# Altium schematic sheet Channel_w_Stim.SchDoc
size A3
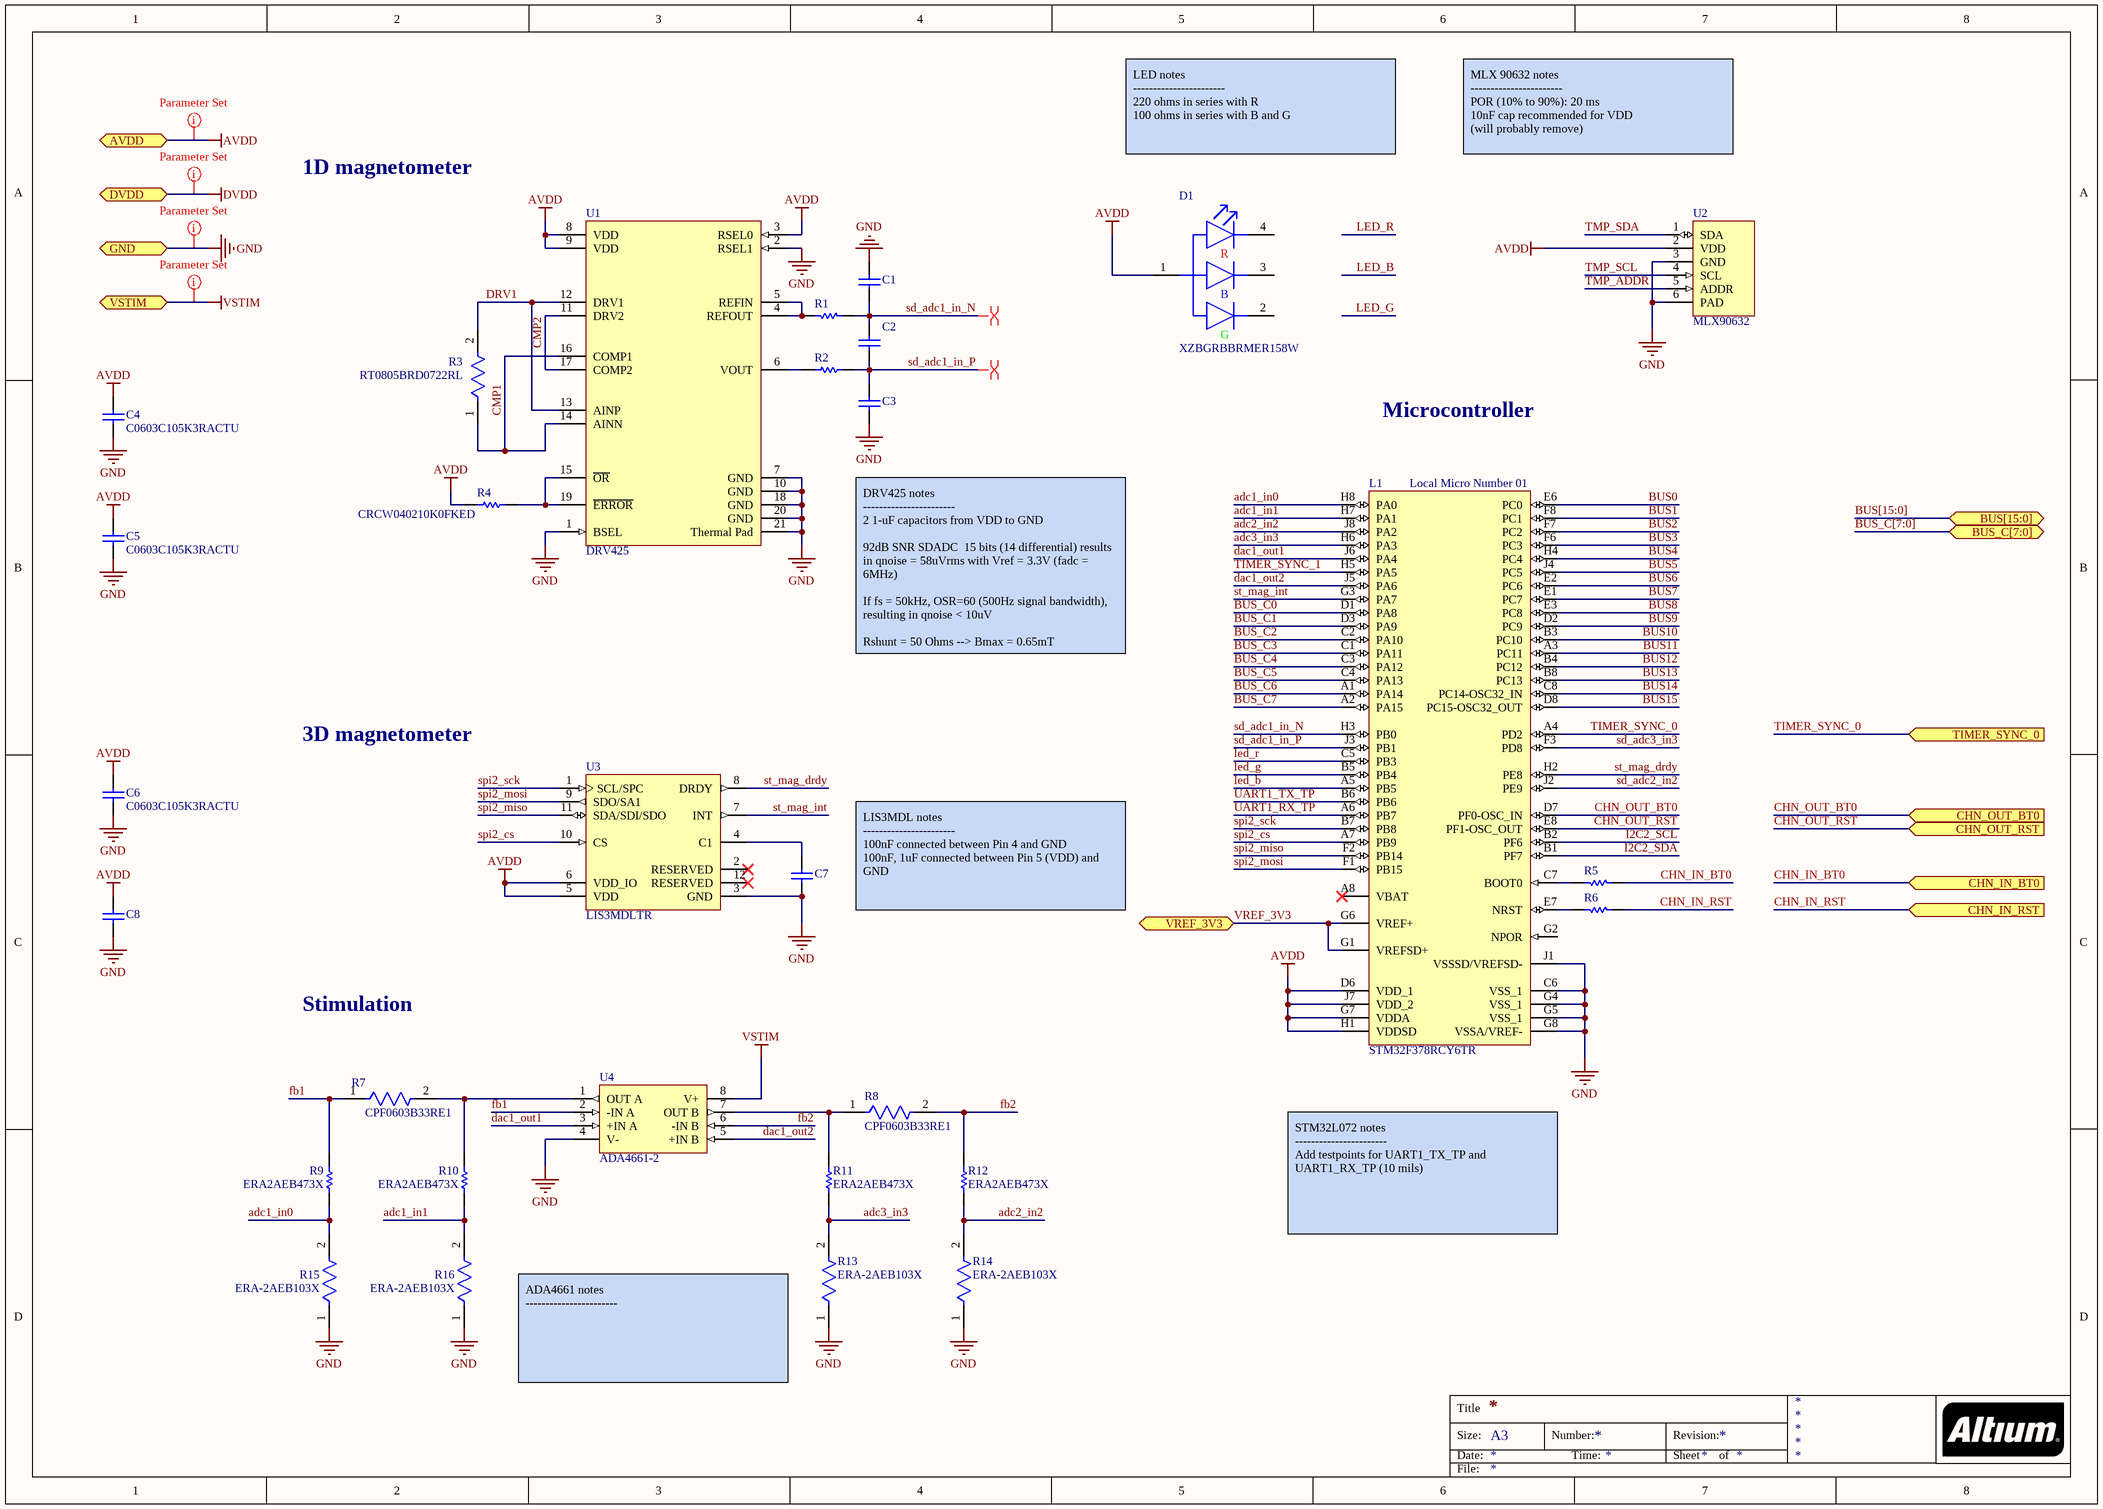
[diagram p0: Channel_w_Stim.SchDoc]

## Parts
C1  GRM155R71C103KA01J  [CAPC1005X55X25LL05T10]  (value not drawn)
C2  GRM155R71C104KA88D  [CAPC1005X55X25NL05T10]  (value not drawn)
C3  GRM155R71C103KA01J  [CAPC1005X55X25LL05T10]  (value not drawn)
C4  C0603C105K3RACTU  [CAPC1608X87X35LL15T15]
C5  C0603C105K3RACTU  [CAPC1608X87X35LL15T15]
C6  C0603C105K3RACTU  [CAPC1608X87X35LL15T15]
C7  GRM155R71C103KA01J  [CAPC1005X55X25LL05T10]  (value not drawn)
C8  GRM155R71C103KA01J  [CAPC1005X55X25LL05T10]  (value not drawn)
D1  XZBGRBBRMER158W  [4-SMD]
L1  STM32F378RCY6TR  [STM-WLCSP66]
R1  RC0402FR-071KL  [RESC1005X40X25NL05T10]  (value not drawn)
R2  RC0402FR-071KL  [RESC1005X40X25NL05T10]  (value not drawn)
R3  RT0805BRD0722RL  [FP-RT0805-MFG]
R4  CRCW040210K0FKED  [RESC1005X40X25NL05T05]
R5  RC0402FR-071KL  [RESC1005X40X25NL05T10]  (value not drawn)
R6  RC0402FR-071KL  [RESC1005X40X25NL05T10]  (value not drawn)
R7  CPF0603B33RE1  [FP-CPF0603-IPC_C]
R8  CPF0603B33RE1  [FP-CPF0603-IPC_C]
R9  ERA2AEB473X  [RESC1005X40X25NL10T10]
R10  ERA2AEB473X  [RESC1005X40X25NL10T10]
R11  ERA2AEB473X  [RESC1005X40X25NL10T10]
R12  ERA2AEB473X  [RESC1005X40X25NL10T10]
R13  ERA-2AEB103X  [FP-ERA2A-MFG]
R14  ERA-2AEB103X  [FP-ERA2A-MFG]
R15  ERA-2AEB103X  [FP-ERA2A-MFG]
R16  ERA-2AEB103X  [FP-ERA2A-MFG]
U1  DRV425  [QFN50P400X400X80_HS-21N]
U2  MLX90632  [SFN 3x3]
U3  LIS3MDLTR  [STM-LGA-12]
U4  ADA4661-2  [LFCSP_WD_8]

## Ports
AVDD (bidir), BUS[15:0] (bidir), BUS_C[7:0] (bidir), CHN_IN_BT0 (in), CHN_IN_RST (in), CHN_OUT_BT0 (in), CHN_OUT_RST (in), DVDD (bidir), GND (bidir), TIMER_SYNC_0 (in), VREF_3V3 (bidir), VSTIM (bidir)

## Nets
AVDD: C4.2 C5.2 C6.2 C8.2 D1.1 L1.D6(VDD_1) L1.G7(VDDA) L1.H1(VDDSD) L1.J7(VDD_2) R4.1 U1.3(RSEL0) U1.8(VDD) U1.9(VDD) U2.2(VDD) U3.5(VDD) U3.6(VDD_IO) ; port AVDD
DVDD: port DVDD
GND: C1.1 C3.1 C4.1 C5.1 C6.1 C7.1 C8.1 L1.C6(VSS_1) L1.G4(VSS_1) L1.G5(VSS_1) L1.G8(VSSA/VREF-) L1.J1(VSSSD/VREFSD-) R13.1 R14.1 R15.1 R16.1 U1.1(BSEL) U1.2(RSEL1) U1.7(GND) U1.10(GND) U1.18(GND) U1.20(GND) U1.21(Thermal_Pad) U2.3(GND) U2.6(PAD) U3.3(GND) U4.4(V-) ; port GND
VSTIM: U4.8(V+) ; port VSTIM
adc1_in0: L1.H8(PA0) R9.1 R15.2
adc1_in1: L1.H7(PA1) R10.1 R16.2
adc2_in2: L1.J8(PA2) R12.1 R14.2
adc3_in3: L1.H6(PA3) R11.1 R13.2
BUS0: L1.E6(PC0)
BUS1: L1.F8(PC1)
BUS2: L1.F7(PC2)
BUS3: L1.F6(PC3)
BUS4: L1.H4(PC4)
BUS5: L1.J4(PC5)
BUS6: L1.E2(PC6)
BUS7: L1.E1(PC7)
BUS8: L1.E3(PC8)
BUS9: L1.D2(PC9)
BUS10: L1.B3(PC10)
BUS11: L1.A3(PC11)
BUS12: L1.B4(PC12)
BUS13: L1.B8(PC13)
BUS14: L1.C8(PC14-OSC32_IN)
BUS15: L1.D8(PC15-OSC32_OUT)
BUS[15:0]: port BUS[15:0]
BUS_C0: L1.D1(PA8)
BUS_C1: L1.D3(PA9)
BUS_C2: L1.C2(PA10)
BUS_C3: L1.C1(PA11)
BUS_C4: L1.C3(PA12)
BUS_C5: L1.C4(PA13)
BUS_C6: L1.A1(PA14)
BUS_C7: L1.A2(PA15)
BUS_C[7:0]: port BUS_C[7:0]
CHN_IN_BT0: R5.2 ; port CHN_IN_BT0
CHN_IN_RST: R6.2 ; port CHN_IN_RST
CHN_OUT_BT0: L1.D7(PF0-OSC_IN) ; port CHN_OUT_BT0
CHN_OUT_RST: L1.E8(PF1-OSC_OUT) ; port CHN_OUT_RST
CMP1: R3.1 U1.14(AINN) U1.16(COMP1)
CMP2: U1.11(DRV2) U1.17(COMP2)
dac1_out1: L1.J6(PA4) U4.3(+IN_A)
dac1_out2: L1.J5(PA6) U4.5(+IN_B)
DRV1: R3.2 U1.12(DRV1) U1.13(AINP)
fb1: R7.1 R9.2 U4.2(-IN_A)
fb2: R8.2 R12.2 U4.6(-IN_B)
I2C2_SCL: L1.B2(PF6)
I2C2_SDA: L1.B1(PF7)
led_b: L1.A5(PB5)
led_g: L1.B5(PB4)
led_r: L1.C5(PB3)
sd_adc1_in_N: C1.2 C2.2 L1.H3(PB0) R1.2
sd_adc1_in_P: C2.1 C3.2 L1.J3(PB1) R2.2
sd_adc2_in2: L1.J2(PE9)
sd_adc3_in3: L1.F3(PD8)
spi2_cs: L1.A7(PB9) U3.10(CS)
spi2_miso: L1.F2(PB14) U3.11(SDA/SDI/SDO)
spi2_mosi: L1.F1(PB15) U3.9(SDO/SA1)
spi2_sck: L1.B7(PB8) U3.1(SCL/SPC)
st_mag_drdy: L1.H2(PE8) U3.8(DRDY)
st_mag_int: L1.G3(PA7) U3.7(INT)
TIMER_SYNC_0: L1.A4(PD2) ; port TIMER_SYNC_0
TIMER_SYNC_1: L1.H5(PA5)
TMP_ADDR: U2.5(ADDR)
TMP_SCL: U2.4(SCL)
TMP_SDA: U2.1(SDA)
UART1_RX_TP: L1.A6(PB7)
UART1_TX_TP: L1.B6(PB6)
VREF_3V3: L1.G1(VREFSD+) L1.G6(VREF+) ; port VREF_3V3
NetC7_2: C7.2 U3.4(C1)
NetL1_C7: L1.C7(BOOT0) R5.1
NetL1_E7: L1.E7(NRST) R6.1
NetR1_1: R1.1 U1.4(REFOUT) U1.5(REFIN)
NetR2_1: R2.1 U1.6(VOUT)
NetR4_2: R4.2 U1.15(~{OR}) U1.19(~{ERROR})
NetR7_2: R7.2 R10.2 U4.1(OUT_A)
NetR8_1: R8.1 R11.2 U4.7(OUT_B)

Not connected (* = marked no-connect by the designer): D1 2 3 4; L1 A8(VBAT)* G2(NPOR); U3 2(RESERVED)* 12(RESERVED)*

## Layout directives
net class Power: AVDD, DVDD, GND, VSTIM
differential pair: sd_adc1_in_N, sd_adc1_in_P

## Notes on the sheet
- 1D magnetometer
- LED notes
  -----------------------
  220 ohms in series with R
  100 ohms in series with B and G
- MLX 90632 notes
  -----------------------
  POR (10% to 90%): 20 ms
  10nF cap recommended for VDD
  (will probably remove)
- Microcontroller
- (near L1) Local Micro Number 01
- DRV425 notes
  -----------------------
  2 1-uF capacitors from VDD to GND
  92dB SNR SDADC  15 bits (14 differential) results in qnoise = 58uVrms with Vref = 3.3V (fadc = 6MHz)
  If fs = 50kHz, OSR=60 (500Hz signal bandwidth), resulting in qnoise < 10uV
  Rshunt = 50 Ohms --> Bmax = 0.65mT
  Expected RMS voltage noise at output of shunt amplifier
- 3D magnetometer
- LIS3MDL notes
  -----------------------
  100nF connected between Pin 4 and GND
  100nF, 1uF connected between Pin 5 (VDD) and GND
- Stimulation
- STM32L072 notes
  -----------------------
  Add testpoints for UART1_TX_TP and UART1_RX_TP (10 mils)
- ADA4661 notes
  -----------------------
- Title
- Size:
- Date:
- A3
- Number:
- Time:
- Revision:
- Sheet
- of
- File:
- (in symbol XZBGRBBRMER158W) R; B; G

## Library data of the parts
C1 C3 C7 C8 = CMP-2008-04598-1: Manufacturer: Murata; Part Number: GRM155R71C103KA01J
C2 = CMP-2100-03641-1: Chip Capacitor, 0.1 uF, +/- 10%, 16 V, -55 to 125 degC, 0402 (1005 Metric), RoHS, Tape and Reel; Manufacturer: Murata; Material: Ceramic; Insulation Resistance: 10GR; Voltage: 16V; Dielectric: X7R; Capacitance: 100nF; REACH SVHC: NoSVHC; Depth: 0.5mm; Case/Package: 0402; Datasheet URL: http://psearch.en.murata.com/capacitor/product/GRM155R71C104KA88%23.pdf; Lead Free: LeadFree; Dielectric Material: Ceramic; Manufacturer URL: http://www.murata.com/; Min Operating Temperature: -55degC; Length: 1mm; Case Code (Metric): 1005; Radiation Hardening: No; Package Reference: 0402; RoHSCompliant: true; Datasheet Version: 42675.0; Thickness: 0.022inch; Packaging: TapeandReel; Voltage Rating (DC): 16V; Tolerance: 10%; Max Operating Temperature: 125degC; Package Description: 2-Pin Surface Mount Device, Body 1 x 0.5 mm; Mount: SurfaceMount; Height: 0.5mm; Width: 0.5mm; Number of Pins: 2; Voltage Rating: 16V; Case Code (Imperial): 0402; Termination: SMD/SMT; Package Quantity: 1
C4-C6 = CMP-2006-03713-1: Manufacturer: Kemet; Part Number: C0603C105K3RACTU
D1 = XZBGRBBRMER158W: 0.65x0.65x0.20mm (0202) Full-Color Surface Mount LED
L1 = CMP-0537-00090-1: ARM Cortex-M4 32-bit MCU, 256 KB Flash, 32 KB Internal RAM, 52 I/Os, 66-Pin WLCSP, -40 to 85 degC, Tape and Reel; Internal RAM Size (kB): 32; Operating Frequency(F) (Processor speed) (MHz): 72; Supply Voltage(Vcc) min (V): 1.65; I/Os (High Current): 52; FLASH Size (Prog) (kB): 256; D/A Converter: 3; Package Reference: WLCSP66; Packing: Tape and Reel; Core: ARM Cortex-M4; ComponentLink1URL: http://www.st.com/; ComponentLink2URL: http://www.st.com/st-web-ui/static/active/en/resource/technical/document/datasheet/DM00101621.pdf; ComponentLink1Description: Manufacturer URL; Mounting Technology: Surface Mount; DatasheetVersion: Rev. 4; Package Description: 66-Ball Wafer Level Chip Size package, 3.767 x 4.229 mm Body, 0.4 mm Pitch; ComponentLink2Description: Datasheet
R1 R2 R5 R6 = CMP-2002-07472-1: Manufacturer: Yageo / Phycomp; Part Number: RC0402FR-071KL
R3 = CMP-03412-022079-1: RES SMD 22 OHM 0.1% 1/8W 0805; Manufacturer: Yageo; Temperature Coefficient: 25 ppm/°C; Resistance: 22Ω; Power Rating: 0.125W; Tolerance: 0.0025; Voltage Rating: 150V; Value: 22Ω; Automotive: No; Octopart: https://octopart.com/rt0805brd0722rl-yageo-1436111; ComponentLink2URL: http://www.yageo.com/documents/recent/PYu-RT_1-to-0.01_RoHS_L_9.pdf; Category: Res; Device Class L3: Chip SMD Resistors; Series: RT; RoHS: TRUE; Digikey Description: RES SMD 22 OHM 0.1% 1/8W 0805; Temperature Range Low: -55°C; Package: RT0805; Mouser Description: Thin Film Resistors - SMD 1/8W 22 ohm .1% 25ppm; Ipc Land Pattern Name: RESC200125X50; Manufacturer Part Number: RT0805BRD0722RL; Lead Free: Yes; Device Class L2: Resistors; Temperature: -55°C to +155°C; Footprint Url: http://www.yageo.com/exep/pages/download/literatures/PYu-R_Mount_10.pdf; Composition: Thin Film; Height: 0.6mm; ComponentLink2Description: Datasheet; Device Class L1: Passive Components; Temperature Range High: +155°C
R4 = CMP-2002-08135-1: Manufacturer: Vishay Dale; Part Number: CRCW040210K0FKED
R7 R8 = CMP-03211-007218-1: RES SMD 33Ω 0.1% 1/16W 0603; Manufacturer: TE Connectivity; Power Rating: 0.063W; Voltage Rating: 50V; Temperature Coefficient: 25ppm/°C; Series: CPF; Lead Free: Yes; octopart_url: https://octopart.com/cpf0603b33re1-te+connectivity-9539400; Height: 0.55mm; Automotive: No; Category: Res; Temperature Range Low: -55°C; RoHS: TRUE; packaging: 1k Reel; Package: CPF0603; Device Class L3: Chip SMD Resistors; ComponentLink2URL: https://www.te.com/commerce/DocumentDelivery/DDEController?Action=showdoc&DocId=Data+Sheet%7F1773200%7FM%7Fpdf%7FEnglish%7FENG_DS_1773200_M.pdf%7F3-1676481-2; Tolerance: 0.1%; Composition: Thin Film; Ipc Land Pattern Name: RESC15580X45; Resistance: 33Ω; Temperature Range High: +155°C; Octopart: https://octopart.com/cpf0603b33re1-te+connectivity-9539400; Device Class L2: Resistors; Device Class L1: Passive Components; Temperature: -55°C to +155°C; Value: 33Ω; ComponentLink2Description: Datasheet; Manufacturer Part Number: CPF0603B33RE1
R9-R12 = CMP-2002-05889-1: Manufacturer: Panasonic; Part Number: ERA2AEB473X
R13-R16 = CMP-05422-000052-1: RES SMD 10K OHM 0.1% 1/16W 0402; Manufacturer: Panasonic; Temperature Coefficient: 25ppm/°C; Automotive Grade: Grade 0; Resistance: 10kΩ; Power Rating: 0.063W; Voltage Rating: 50V; Value: 10kΩ; RoHS: TRUE; Device Class L3: Chip SMD Resistors; Automotive: Yes; Series: ERA; Height: 0.4mm; Package: ERA2A; Temperature Range Low: -55°C; ComponentLink2Description: Datasheet; Tolerance: 0.1%; Device Class L2: Resistors; Temperature Range High: +155°C; Device Class L1: Passive Components; Digikey Description: RES SMD 10K OHM 0.1% 1/16W 0402; Manufacturer Part Number: ERA-2AEB103X; Category: Res; Mouser Description: Thin Film Resistors - SMD 0402 1/16W 10Kohms; Lead Free: Yes; Footprint Url: https://industrial.panasonic.com/cdbs/www-data/pdf/RDM0000/DMM0000COL17.pdf; Composition: Metal Film; Octopart: https://octopart.com/era-2aeb103x-panasonic-9251377; ComponentLink2URL: https://industrial.panasonic.com/cdbs/www-data/pdf/RDM0000/AOA0000C307.pdf; Temperature: -55°C to +155°C
U1 = DRV425: Texas Instruments Fluxgate Magnetic-Field Sensor
U2 = MLX90632: FIR temperature sensor
U3 = CMP-2000-07463-1: Digital Output Magnetic Sensor: Ultra-Low-Power, High-Performance 3-Axis Magnetometer, 1.9 to 3.6 V, -40 to 85 degC, 12-Pin LGA, RoHS, Tape and Reel; Manufacturer: STMicroelectronics; Max Supply Current: 270uA; Case\/Package: Module; Min Supply Voltage: 1.9V; Max Supply Voltage: 3.6V; Resolution: 16b; RoHSCompliant: true; Datasheet Version: Rev. 6, 05/2017; REACH SVHC: NoSVHC; Lead Free: LeadFree; Package Quantity: 8000; Package Description: 12-Pin Land Grid Array Package, Body 2 x 2 mm, Pitch 0.5 mm; Package Reference: LGA-12; Packaging: TapeandReel; Min Operating Temperature: -40degC; Mount: SurfaceMount; Contact Plating: Gold; Datasheet URL: http://www.st.com/content/ccc/resource/technical/document/datasheet/54/2a/85/76/e3/97/42/18/DM00075867.pdf/files/DM00075867.pdf/jcr:content/translations/en.DM00075867.pdf; Mounting Technology: SurfaceMount; Radiation Hardening: No; Number of Pins: 12; Max Operating Temperature: 85degC; Manufacturer URL: http://www.st.com/